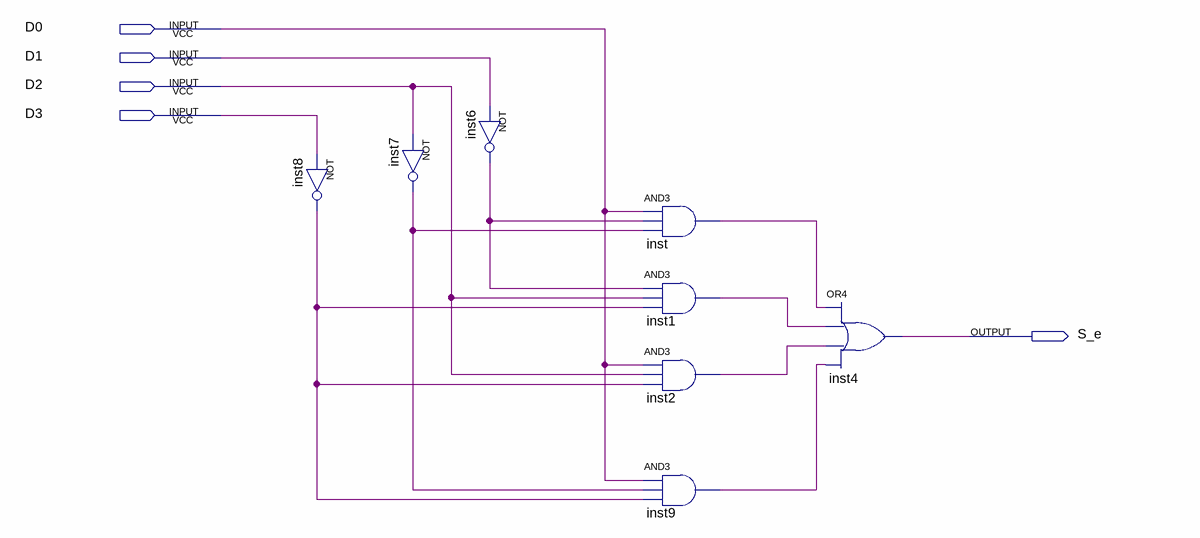
[diagram p0: schematic sheet]
// Quartus schematic S_e.bdf as structural Verilog: 8 symbols, 5 pins
module S_e (
  input  D0,
  input  D1,
  input  D2,
  input  D3,
  output S_e
);

  wire inst1_out, inst2_out, inst6_out, inst7_out, inst8_out, inst9_out, inst_out;

  not inst8 (inst8_out, D3);
  not inst7 (inst7_out, D2);
  not inst6 (inst6_out, D1);
  and inst (inst_out, D0, inst6_out, inst7_out);
  and inst1 (inst1_out, inst6_out, D2, inst8_out);
  and inst2 (inst2_out, D0, D2, inst8_out);
  and inst9 (inst9_out, D0, inst7_out, inst8_out);
  or inst4 (S_e, inst_out, inst1_out, inst2_out, inst9_out);
endmodule
